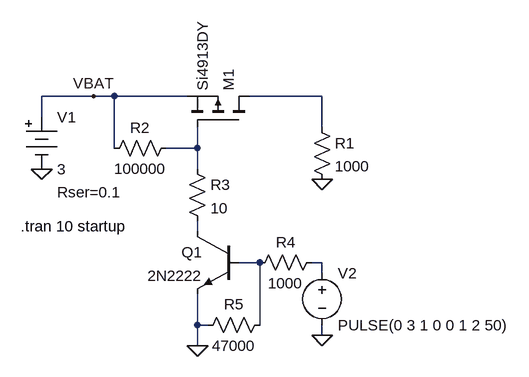
[diagram p0: schematic selbsthaltenderREED.asc]
selbsthaltenderREED.asc, the LTspice schematic file:
Version 4
SHEET 1 880 680
WIRE 16 96 -64 96
WIRE 48 96 16 96
WIRE 160 96 48 96
WIRE 368 96 256 96
WIRE -64 128 -64 96
WIRE 368 144 368 96
WIRE 48 176 48 96
WIRE 176 176 176 144
WIRE 176 176 128 176
WIRE 176 208 176 176
WIRE 176 304 176 288
WIRE 272 352 240 352
WIRE 368 352 352 352
WIRE 368 368 368 352
WIRE 176 448 176 400
WIRE 192 448 176 448
WIRE 272 448 272 352
WIRE 368 464 368 448
WIRE 176 480 176 448
FLAG -64 208 0
FLAG 368 464 0
FLAG 368 224 0
FLAG 16 96 VBAT
FLAG 176 480 0
SYMBOL pmos 256 144 M270
SYMATTR InstName M1
SYMATTR Value Si4913DY
SYMBOL Misc\\battery -64 112 R0
WINDOW 123 0 0 Left 0
WINDOW 39 24 132 Left 2
SYMATTR SpiceLine Rser=0.1
SYMATTR InstName V1
SYMATTR Value 3
SYMBOL voltage 368 352 R0
WINDOW 123 0 0 Left 0
WINDOW 39 0 0 Left 0
SYMATTR InstName V2
SYMATTR Value PULSE(0 3 1 0 0 1 2 50)
SYMBOL res 352 128 R0
SYMATTR InstName R1
SYMATTR Value 1000
SYMATTR SpiceLine tol=1
SYMBOL res 144 160 R90
WINDOW 0 0 56 VBottom 2
WINDOW 3 32 56 VTop 2
SYMATTR InstName R2
SYMATTR Value 100000
SYMATTR SpiceLine tol=1
SYMBOL npn 240 304 M0
SYMATTR InstName Q1
SYMATTR Value 2N2222
SYMBOL res 160 192 R0
SYMATTR InstName R3
SYMATTR Value 10
SYMATTR SpiceLine tol=1
SYMBOL res 368 336 R90
WINDOW 0 0 56 VBottom 2
WINDOW 3 32 56 VTop 2
SYMATTR InstName R4
SYMATTR Value 1000
SYMATTR SpiceLine tol=1
SYMBOL res 288 432 R90
WINDOW 0 0 56 VBottom 2
WINDOW 3 32 56 VTop 2
SYMATTR InstName R5
SYMATTR Value 47000
SYMATTR SpiceLine tol=1
TEXT -96 296 Left 2 !.tran 10 startup

The netlist it stands for:
* selbsthaltenderREED.asc
M1 N001 N002 VBAT VBAT Si4913DY
V1 VBAT 0 3 Rser=0.1
V2 N005 0 PULSE(0 3 1 0 0 1 2 50)
R1 N001 0 1000 tol=1
R2 N002 VBAT 100000 tol=1
Q1 N003 N004 0 0 2N2222
R3 N002 N003 10 tol=1
R4 N005 N004 1000 tol=1
R5 N004 0 47000 tol=1
.model NPN NPN
.model PNP PNP
.lib standard.bjt
.model NMOS NMOS
.model PMOS PMOS
.lib standard.mos
.tran 10 startup
.backanno
.end